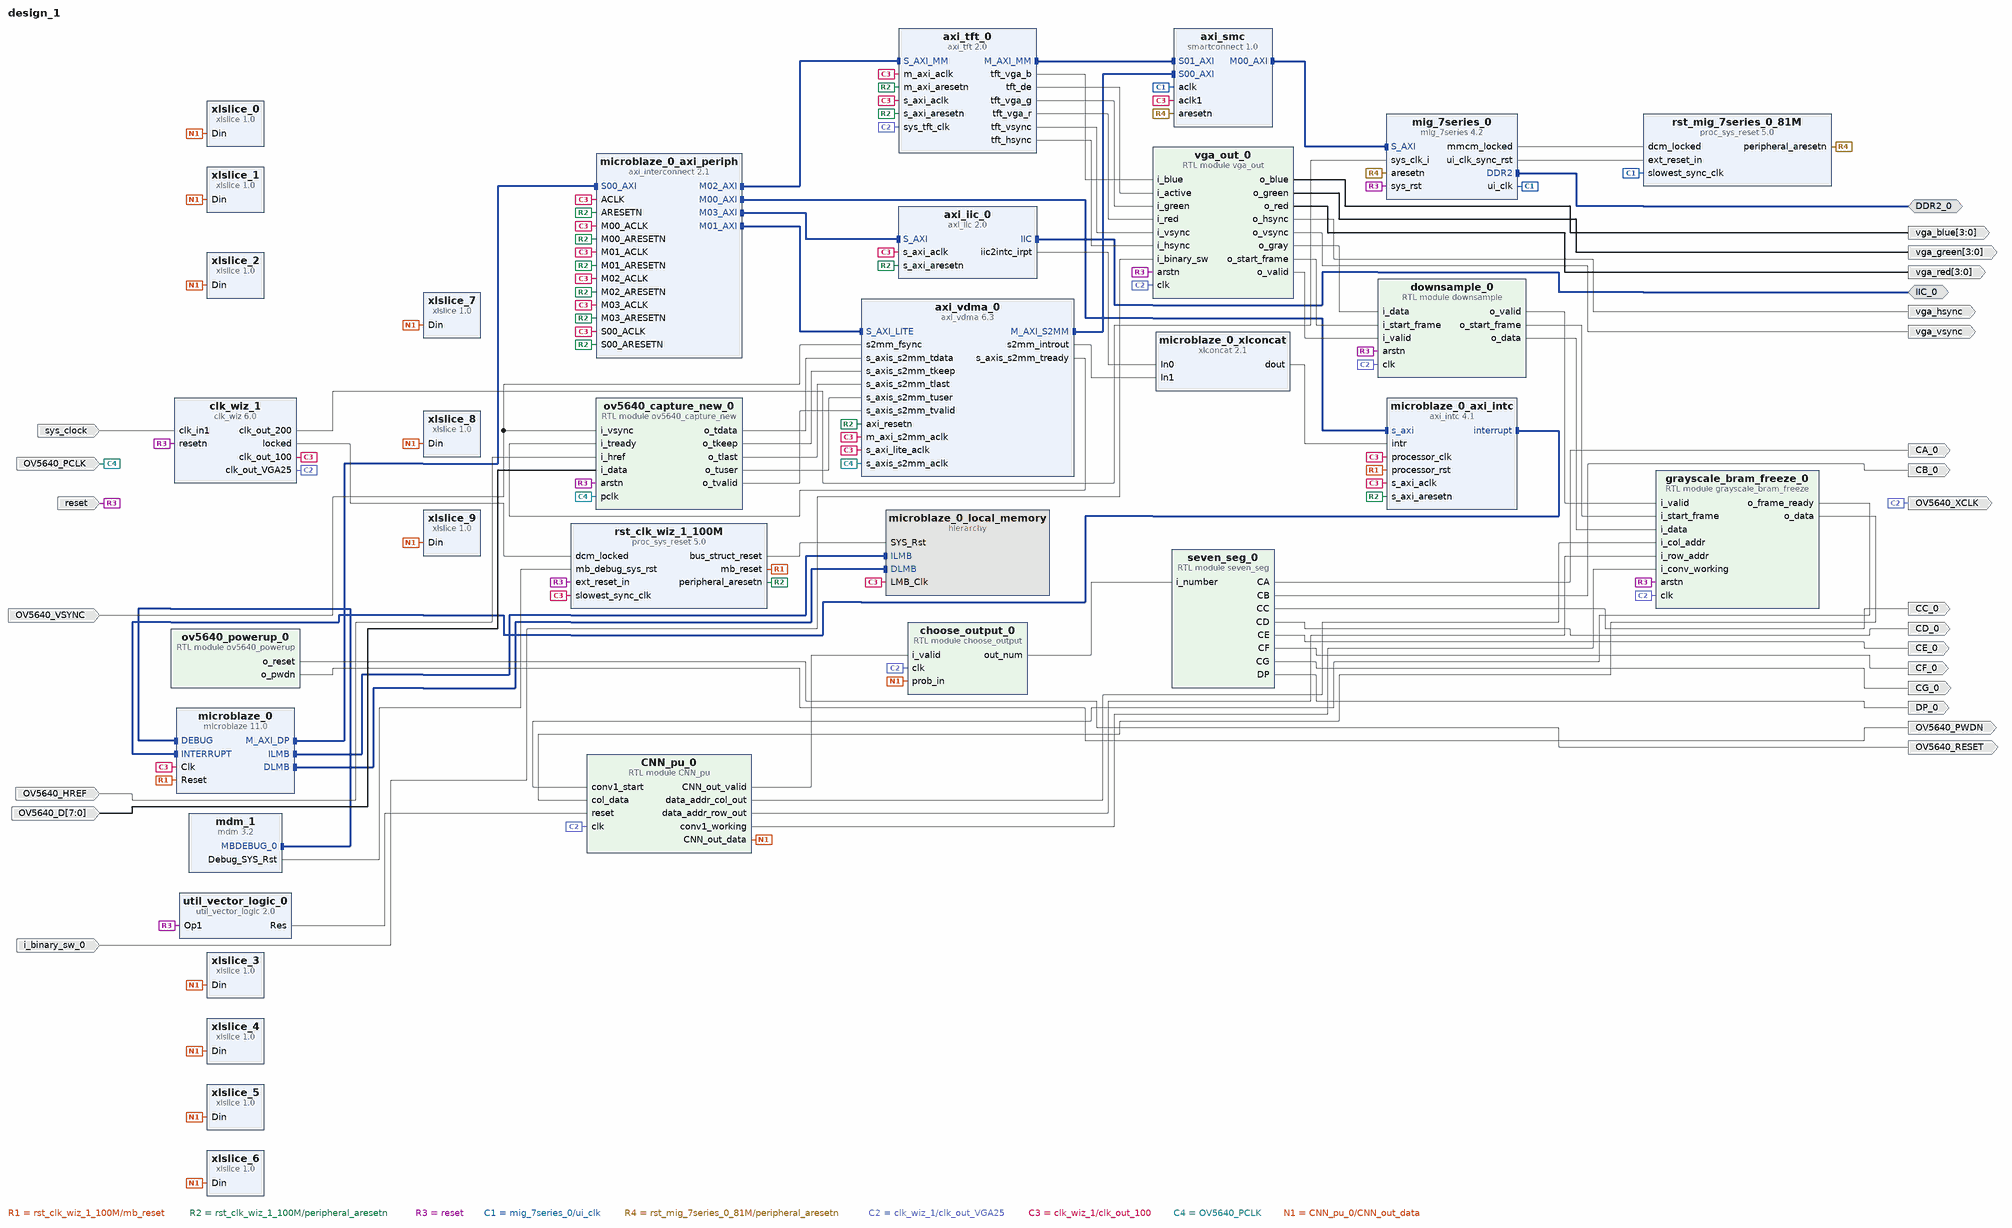
[diagram p0: block diagram of the top level]
# Vivado block design design_1, xc7a100tcsg324-1, Vivado 2018.3
create_bd_design design_1

create_bd_intf_port -mode Master -vlnv xilinx.com:interface:ddrx_rtl:1.0 DDR2_0
create_bd_intf_port -mode Master -vlnv xilinx.com:interface:iic_rtl:1.0 IIC_0
create_bd_port -dir I -type clk sys_clock
create_bd_port -dir I -type rst reset
set_property -dict {CONFIG.POLARITY ACTIVE_LOW} [get_bd_ports reset]
create_bd_port -dir O -type clk OV5640_XCLK
set_property -dict {CONFIG.FREQ_HZ 25000000} [get_bd_ports OV5640_XCLK]
create_bd_port -dir I -type clk OV5640_PCLK
set_property -dict {CONFIG.ASSOCIATED_BUSIF frame_in} [get_bd_ports OV5640_PCLK]
create_bd_port -dir O -from 3 -to 0 vga_red
create_bd_port -dir O -from 3 -to 0 vga_green
create_bd_port -dir O -from 3 -to 0 vga_blue
create_bd_port -dir I OV5640_VSYNC
create_bd_port -dir I OV5640_HREF
create_bd_port -dir I -from 7 -to 0 OV5640_D
create_bd_port -dir O vga_hsync
create_bd_port -dir O vga_vsync
create_bd_port -dir O -type rst OV5640_RESET
create_bd_port -dir O OV5640_PWDN
create_bd_port -dir O CA_0
create_bd_port -dir O CB_0
create_bd_port -dir O CC_0
create_bd_port -dir O CD_0
create_bd_port -dir O CE_0
create_bd_port -dir O CF_0
create_bd_port -dir O CG_0
create_bd_port -dir O DP_0
create_bd_port -dir I i_binary_sw_0

create_bd_cell -type ip -vlnv xilinx.com:ip:axi_intc:4.1 microblaze_0_axi_intc
set_property -dict {CONFIG.C_HAS_FAST 1} [get_bd_cells microblaze_0_axi_intc]
create_bd_cell -type ip -vlnv xilinx.com:ip:xlconcat:2.1 microblaze_0_xlconcat
create_bd_cell -type ip -vlnv xilinx.com:ip:mdm:3.2 mdm_1
create_bd_cell -type ip -vlnv xilinx.com:ip:clk_wiz:6.0 clk_wiz_1
set_property -dict [list \
  CONFIG.CLKOUT1_JITTER 151.636 \
  CONFIG.CLKOUT1_REQUESTED_OUT_FREQ 50 \
  CONFIG.CLKOUT2_JITTER 175.402 \
  CONFIG.CLKOUT2_PHASE_ERROR 98.575 \
  CONFIG.CLKOUT2_REQUESTED_OUT_FREQ 25.175 \
  CONFIG.CLKOUT2_USED true \
  CONFIG.CLKOUT3_JITTER 114.829 \
  CONFIG.CLKOUT3_PHASE_ERROR 98.575 \
  CONFIG.CLKOUT3_REQUESTED_OUT_FREQ 200 \
  CONFIG.CLKOUT3_USED true \
  CONFIG.CLK_IN1_BOARD_INTERFACE sys_clock \
  CONFIG.CLK_OUT1_PORT clk_out_100 \
  CONFIG.CLK_OUT2_PORT clk_out_VGA25 \
  CONFIG.CLK_OUT3_PORT clk_out_200 \
  CONFIG.MMCM_CLKOUT0_DIVIDE_F 20.000 \
  CONFIG.MMCM_CLKOUT1_DIVIDE 40 \
  CONFIG.MMCM_CLKOUT2_DIVIDE 5 \
  CONFIG.MMCM_DIVCLK_DIVIDE 1 \
  CONFIG.NUM_OUT_CLKS 3 \
  CONFIG.PRIM_SOURCE Single_ended_clock_capable_pin \
  CONFIG.RESET_BOARD_INTERFACE reset \
  CONFIG.RESET_PORT resetn \
  CONFIG.RESET_TYPE ACTIVE_LOW \
  CONFIG.USE_BOARD_FLOW true \
] [get_bd_cells clk_wiz_1]
create_bd_cell -type ip -vlnv xilinx.com:ip:proc_sys_reset:5.0 rst_clk_wiz_1_100M
set_property -dict {CONFIG.RESET_BOARD_INTERFACE reset CONFIG.USE_BOARD_FLOW true} [get_bd_cells rst_clk_wiz_1_100M]
create_bd_cell -type ip -vlnv xilinx.com:ip:mig_7series:4.2 mig_7series_0
set_property -dict {CONFIG.RESET_BOARD_INTERFACE reset} [get_bd_cells mig_7series_0]
create_bd_cell -type ip -vlnv xilinx.com:ip:axi_tft:2.0 axi_tft_0
set_property -dict {CONFIG.C_EN_I2C_INTF 0 CONFIG.C_TFT_INTERFACE 0} [get_bd_cells axi_tft_0]
create_bd_cell -type ip -vlnv xilinx.com:ip:smartconnect:1.0 axi_smc
set_property -dict {CONFIG.NUM_CLKS 2 CONFIG.NUM_SI 2} [get_bd_cells axi_smc]
create_bd_cell -type ip -vlnv xilinx.com:ip:proc_sys_reset:5.0 rst_mig_7series_0_81M
create_bd_cell -type ip -vlnv xilinx.com:ip:axi_iic:2.0 axi_iic_0
set_property -dict {CONFIG.IIC_BOARD_INTERFACE Custom CONFIG.IIC_FREQ_KHZ 10 CONFIG.USE_BOARD_FLOW true} [get_bd_cells axi_iic_0]
create_bd_cell -type ip -vlnv xilinx.com:ip:axi_vdma:6.3 axi_vdma_0
set_property -dict [list \
  CONFIG.c_include_mm2s 0 \
  CONFIG.c_num_fstores 5 \
  CONFIG.c_s2mm_genlock_mode 0 \
  CONFIG.c_s2mm_max_burst_length 8 \
  CONFIG.c_use_s2mm_fsync 1 \
] [get_bd_cells axi_vdma_0]
create_bd_cell -type ip -vlnv xilinx.com:ip:axi_interconnect:2.1 microblaze_0_axi_periph
set_property -dict {CONFIG.NUM_MI 4 CONFIG.NUM_SI 1} [get_bd_cells microblaze_0_axi_periph]
create_bd_cell -type hier microblaze_0_local_memory
create_bd_cell -type ip -vlnv xilinx.com:ip:microblaze:11.0 microblaze_0
set_property -dict {CONFIG.C_DEBUG_ENABLED 1 CONFIG.C_D_AXI 1 CONFIG.C_D_LMB 1 CONFIG.C_I_LMB 1} [get_bd_cells microblaze_0]
create_bd_cell -type module -reference ov5640_powerup ov5640_powerup_0
create_bd_cell -type module -reference ov5640_capture_new ov5640_capture_new_0
create_bd_cell -type ip -vlnv xilinx.com:ip:util_vector_logic:2.0 util_vector_logic_0
set_property -dict {CONFIG.C_OPERATION not CONFIG.C_SIZE 1} [get_bd_cells util_vector_logic_0]
create_bd_cell -type module -reference CNN_pu CNN_pu_0
create_bd_cell -type ip -vlnv xilinx.com:ip:xlslice:1.0 xlslice_0
set_property -dict {CONFIG.DIN_FROM 15 CONFIG.DIN_TO 0 CONFIG.DIN_WIDTH 160 CONFIG.DOUT_WIDTH 16} [get_bd_cells xlslice_0]
create_bd_cell -type ip -vlnv xilinx.com:ip:xlslice:1.0 xlslice_1
set_property -dict {CONFIG.DIN_FROM 31 CONFIG.DIN_TO 16 CONFIG.DIN_WIDTH 160 CONFIG.DOUT_WIDTH 16} [get_bd_cells xlslice_1]
create_bd_cell -type ip -vlnv xilinx.com:ip:xlslice:1.0 xlslice_2
set_property -dict {CONFIG.DIN_FROM 47 CONFIG.DIN_TO 32 CONFIG.DIN_WIDTH 160 CONFIG.DOUT_WIDTH 1} [get_bd_cells xlslice_2]
create_bd_cell -type ip -vlnv xilinx.com:ip:xlslice:1.0 xlslice_3
set_property -dict {CONFIG.DIN_FROM 63 CONFIG.DIN_TO 48 CONFIG.DIN_WIDTH 160 CONFIG.DOUT_WIDTH 1} [get_bd_cells xlslice_3]
create_bd_cell -type ip -vlnv xilinx.com:ip:xlslice:1.0 xlslice_4
set_property -dict {CONFIG.DIN_FROM 79 CONFIG.DIN_TO 64 CONFIG.DIN_WIDTH 160} [get_bd_cells xlslice_4]
create_bd_cell -type ip -vlnv xilinx.com:ip:xlslice:1.0 xlslice_5
set_property -dict {CONFIG.DIN_FROM 95 CONFIG.DIN_TO 80 CONFIG.DIN_WIDTH 160 CONFIG.DOUT_WIDTH 16} [get_bd_cells xlslice_5]
create_bd_cell -type ip -vlnv xilinx.com:ip:xlslice:1.0 xlslice_6
set_property -dict {CONFIG.DIN_FROM 111 CONFIG.DIN_TO 96 CONFIG.DIN_WIDTH 160 CONFIG.DOUT_WIDTH 1} [get_bd_cells xlslice_6]
create_bd_cell -type ip -vlnv xilinx.com:ip:xlslice:1.0 xlslice_7
set_property -dict {CONFIG.DIN_FROM 127 CONFIG.DIN_TO 112 CONFIG.DIN_WIDTH 160 CONFIG.DOUT_WIDTH 1} [get_bd_cells xlslice_7]
create_bd_cell -type ip -vlnv xilinx.com:ip:xlslice:1.0 xlslice_8
set_property -dict {CONFIG.DIN_FROM 143 CONFIG.DIN_TO 128 CONFIG.DIN_WIDTH 160 CONFIG.DOUT_WIDTH 1} [get_bd_cells xlslice_8]
create_bd_cell -type ip -vlnv xilinx.com:ip:xlslice:1.0 xlslice_9
set_property -dict {CONFIG.DIN_FROM 159 CONFIG.DIN_TO 144 CONFIG.DIN_WIDTH 160 CONFIG.DOUT_WIDTH 16} [get_bd_cells xlslice_9]
create_bd_cell -type module -reference choose_output choose_output_0
create_bd_cell -type module -reference seven_seg seven_seg_0
create_bd_cell -type module -reference vga_out vga_out_0
create_bd_cell -type module -reference downsample downsample_0
create_bd_cell -type module -reference grayscale_bram_freeze grayscale_bram_freeze_0

# ---- hierarchy /microblaze_0_local_memory ----
current_bd_instance /microblaze_0_local_memory
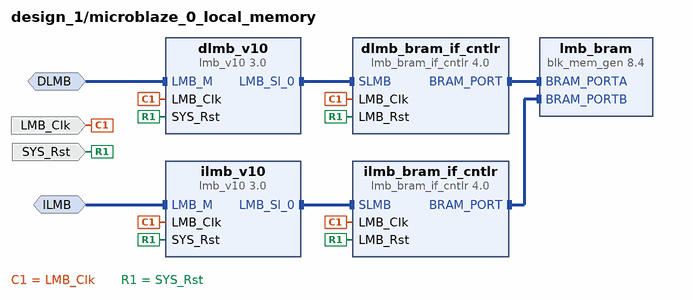
[diagram p1: block diagram inside /microblaze_0_local_memory]
create_bd_intf_pin -mode MirroredMaster -vlnv xilinx.com:interface:lmb_rtl:1.0 DLMB
create_bd_intf_pin -mode MirroredMaster -vlnv xilinx.com:interface:lmb_rtl:1.0 ILMB
create_bd_pin -dir I -type clk LMB_Clk
create_bd_pin -dir I -type rst SYS_Rst

create_bd_cell -type ip -vlnv xilinx.com:ip:lmb_v10:3.0 dlmb_v10
create_bd_cell -type ip -vlnv xilinx.com:ip:lmb_v10:3.0 ilmb_v10
create_bd_cell -type ip -vlnv xilinx.com:ip:lmb_bram_if_cntlr:4.0 dlmb_bram_if_cntlr
set_property -dict {CONFIG.C_ECC 0} [get_bd_cells dlmb_bram_if_cntlr]
create_bd_cell -type ip -vlnv xilinx.com:ip:lmb_bram_if_cntlr:4.0 ilmb_bram_if_cntlr
set_property -dict {CONFIG.C_ECC 0} [get_bd_cells ilmb_bram_if_cntlr]
create_bd_cell -type ip -vlnv xilinx.com:ip:blk_mem_gen:8.4 lmb_bram
set_property -dict {CONFIG.Memory_Type True_Dual_Port_RAM CONFIG.use_bram_block BRAM_Controller} [get_bd_cells lmb_bram]

# ---- connections ----

current_bd_instance /microblaze_0_local_memory
connect_bd_intf_net -intf_net microblaze_0_ilmb [get_bd_intf_pins ILMB] [get_bd_intf_pins ilmb_v10/LMB_M]
connect_bd_intf_net -intf_net microblaze_0_ilmb_bus [get_bd_intf_pins ilmb_v10/LMB_Sl_0] [get_bd_intf_pins ilmb_bram_if_cntlr/SLMB]
connect_bd_intf_net -intf_net microblaze_0_dlmb_cntlr [get_bd_intf_pins dlmb_bram_if_cntlr/BRAM_PORT] [get_bd_intf_pins lmb_bram/BRAM_PORTA]
connect_bd_intf_net -intf_net microblaze_0_dlmb [get_bd_intf_pins DLMB] [get_bd_intf_pins dlmb_v10/LMB_M]
connect_bd_intf_net -intf_net microblaze_0_dlmb_bus [get_bd_intf_pins dlmb_v10/LMB_Sl_0] [get_bd_intf_pins dlmb_bram_if_cntlr/SLMB]
connect_bd_intf_net -intf_net microblaze_0_ilmb_cntlr [get_bd_intf_pins ilmb_bram_if_cntlr/BRAM_PORT] [get_bd_intf_pins lmb_bram/BRAM_PORTB]
connect_bd_net -net microblaze_0_Clk [get_bd_pins LMB_Clk] \
  [get_bd_pins dlmb_v10/LMB_Clk] [get_bd_pins dlmb_bram_if_cntlr/LMB_Clk] [get_bd_pins ilmb_v10/LMB_Clk] \
  [get_bd_pins ilmb_bram_if_cntlr/LMB_Clk]
connect_bd_net [get_bd_pins SYS_Rst] \
  [get_bd_pins dlmb_v10/SYS_Rst] [get_bd_pins dlmb_bram_if_cntlr/LMB_Rst] [get_bd_pins ilmb_v10/SYS_Rst] \
  [get_bd_pins ilmb_bram_if_cntlr/LMB_Rst]
set_property HDL_ATTRIBUTE.BMM_INFO_ADDRESS_SPACE {byte  0x00000000 32 > design_1 microblaze_0_local_memory/lmb_bram} [get_bd_cells dlmb_bram_if_cntlr]
set_property HDL_ATTRIBUTE.KEEP_HIERARCHY yes [get_bd_cells dlmb_bram_if_cntlr]

current_bd_instance /
connect_bd_intf_net [get_bd_intf_pins microblaze_0_axi_intc/interrupt] [get_bd_intf_pins microblaze_0/INTERRUPT]
connect_bd_intf_net [get_bd_intf_pins mdm_1/MBDEBUG_0] [get_bd_intf_pins microblaze_0/DEBUG]
connect_bd_intf_net [get_bd_intf_pins microblaze_0_axi_periph/M02_AXI] [get_bd_intf_pins axi_tft_0/S_AXI_MM]
connect_bd_intf_net [get_bd_intf_pins axi_tft_0/M_AXI_MM] [get_bd_intf_pins axi_smc/S01_AXI]
connect_bd_intf_net [get_bd_intf_ports IIC_0] [get_bd_intf_pins axi_iic_0/IIC]
connect_bd_intf_net [get_bd_intf_pins microblaze_0_axi_periph/M03_AXI] [get_bd_intf_pins axi_iic_0/S_AXI]
connect_bd_intf_net [get_bd_intf_pins microblaze_0/ILMB] [get_bd_intf_pins microblaze_0_local_memory/ILMB]
connect_bd_intf_net [get_bd_intf_pins axi_smc/M00_AXI] [get_bd_intf_pins mig_7series_0/S_AXI]
connect_bd_intf_net [get_bd_intf_pins microblaze_0_axi_periph/M01_AXI] [get_bd_intf_pins axi_vdma_0/S_AXI_LITE]
connect_bd_intf_net [get_bd_intf_pins axi_vdma_0/M_AXI_S2MM] [get_bd_intf_pins axi_smc/S00_AXI]
connect_bd_intf_net -intf_net microblaze_0_intc_axi [get_bd_intf_pins microblaze_0_axi_periph/M00_AXI] [get_bd_intf_pins microblaze_0_axi_intc/s_axi]
connect_bd_intf_net [get_bd_intf_ports DDR2_0] [get_bd_intf_pins mig_7series_0/DDR2]
connect_bd_intf_net -intf_net microblaze_0_axi_dp [get_bd_intf_pins microblaze_0_axi_periph/S00_AXI] [get_bd_intf_pins microblaze_0/M_AXI_DP]
connect_bd_intf_net [get_bd_intf_pins microblaze_0/DLMB] [get_bd_intf_pins microblaze_0_local_memory/DLMB]
connect_bd_net -net microblaze_0_intr [get_bd_pins microblaze_0_xlconcat/dout] [get_bd_pins microblaze_0_axi_intc/intr]
connect_bd_net [get_bd_pins clk_wiz_1/locked] [get_bd_pins rst_clk_wiz_1_100M/dcm_locked]
connect_bd_net [get_bd_pins rst_clk_wiz_1_100M/mb_reset] [get_bd_pins microblaze_0_axi_intc/processor_rst] [get_bd_pins microblaze_0/Reset]
connect_bd_net [get_bd_pins rst_clk_wiz_1_100M/peripheral_aresetn] \
  [get_bd_pins microblaze_0_axi_intc/s_axi_aresetn] [get_bd_pins axi_tft_0/s_axi_aresetn] \
  [get_bd_pins axi_tft_0/m_axi_aresetn] [get_bd_pins axi_iic_0/s_axi_aresetn] [get_bd_pins axi_vdma_0/axi_resetn] \
  [get_bd_pins microblaze_0_axi_periph/ARESETN] [get_bd_pins microblaze_0_axi_periph/M03_ARESETN] \
  [get_bd_pins microblaze_0_axi_periph/M02_ARESETN] [get_bd_pins microblaze_0_axi_periph/M01_ARESETN] \
  [get_bd_pins microblaze_0_axi_periph/M00_ARESETN] [get_bd_pins microblaze_0_axi_periph/S00_ARESETN]
connect_bd_net [get_bd_pins mdm_1/Debug_SYS_Rst] [get_bd_pins rst_clk_wiz_1_100M/mb_debug_sys_rst]
connect_bd_net -net clk_in1_0_1 [get_bd_ports sys_clock] [get_bd_pins clk_wiz_1/clk_in1]
connect_bd_net [get_bd_ports reset] \
  [get_bd_pins clk_wiz_1/resetn] [get_bd_pins rst_clk_wiz_1_100M/ext_reset_in] [get_bd_pins mig_7series_0/sys_rst] \
  [get_bd_pins ov5640_capture_new_0/arstn] [get_bd_pins util_vector_logic_0/Op1] [get_bd_pins vga_out_0/arstn] \
  [get_bd_pins downsample_0/arstn] [get_bd_pins grayscale_bram_freeze_0/arstn]
connect_bd_net [get_bd_pins mig_7series_0/ui_clk] [get_bd_pins axi_smc/aclk] [get_bd_pins rst_mig_7series_0_81M/slowest_sync_clk]
connect_bd_net [get_bd_pins mig_7series_0/mmcm_locked] [get_bd_pins rst_mig_7series_0_81M/dcm_locked]
connect_bd_net [get_bd_pins mig_7series_0/ui_clk_sync_rst] [get_bd_pins rst_mig_7series_0_81M/ext_reset_in]
connect_bd_net [get_bd_pins rst_mig_7series_0_81M/peripheral_aresetn] [get_bd_pins mig_7series_0/aresetn] [get_bd_pins axi_smc/aresetn]
connect_bd_net [get_bd_pins clk_wiz_1/clk_out_VGA25] \
  [get_bd_ports OV5640_XCLK] [get_bd_pins axi_tft_0/sys_tft_clk] [get_bd_pins CNN_pu_0/clk] [get_bd_pins choose_output_0/clk] \
  [get_bd_pins vga_out_0/clk] [get_bd_pins downsample_0/clk] [get_bd_pins grayscale_bram_freeze_0/clk]
connect_bd_net [get_bd_pins clk_wiz_1/clk_out_200] [get_bd_pins mig_7series_0/sys_clk_i]
connect_bd_net [get_bd_pins clk_wiz_1/clk_out_100] \
  [get_bd_pins microblaze_0_axi_intc/s_axi_aclk] [get_bd_pins axi_tft_0/s_axi_aclk] [get_bd_pins axi_tft_0/m_axi_aclk] \
  [get_bd_pins axi_iic_0/s_axi_aclk] [get_bd_pins microblaze_0_axi_intc/processor_clk] \
  [get_bd_pins rst_clk_wiz_1_100M/slowest_sync_clk] [get_bd_pins axi_smc/aclk1] [get_bd_pins axi_vdma_0/s_axi_lite_aclk] \
  [get_bd_pins axi_vdma_0/m_axi_s2mm_aclk] [get_bd_pins microblaze_0_axi_periph/ACLK] \
  [get_bd_pins microblaze_0_axi_periph/M03_ACLK] [get_bd_pins microblaze_0_axi_periph/M02_ACLK] \
  [get_bd_pins microblaze_0_axi_periph/M01_ACLK] [get_bd_pins microblaze_0_axi_periph/M00_ACLK] \
  [get_bd_pins microblaze_0_axi_periph/S00_ACLK] [get_bd_pins microblaze_0_local_memory/LMB_Clk] \
  [get_bd_pins microblaze_0/Clk]
connect_bd_net -net s_axis_s2mm_aclk_0_1 [get_bd_ports OV5640_PCLK] [get_bd_pins axi_vdma_0/s_axis_s2mm_aclk] [get_bd_pins ov5640_capture_new_0/pclk]
connect_bd_net [get_bd_pins axi_vdma_0/s2mm_introut] [get_bd_pins microblaze_0_xlconcat/In1]
connect_bd_net [get_bd_pins axi_iic_0/iic2intc_irpt] [get_bd_pins microblaze_0_xlconcat/In0]
connect_bd_net [get_bd_pins rst_clk_wiz_1_100M/bus_struct_reset] [get_bd_pins microblaze_0_local_memory/SYS_Rst]
connect_bd_net [get_bd_pins vga_out_0/o_red] [get_bd_ports vga_red]
connect_bd_net [get_bd_pins vga_out_0/o_green] [get_bd_ports vga_green]
connect_bd_net [get_bd_pins vga_out_0/o_blue] [get_bd_ports vga_blue]
connect_bd_net -net i_vsync_0_1 [get_bd_ports OV5640_VSYNC] [get_bd_pins axi_vdma_0/s2mm_fsync] [get_bd_pins ov5640_capture_new_0/i_vsync]
connect_bd_net -net i_href_0_1 [get_bd_ports OV5640_HREF] [get_bd_pins ov5640_capture_new_0/i_href]
connect_bd_net -net i_data_0_1 [get_bd_ports OV5640_D] [get_bd_pins ov5640_capture_new_0/i_data]
connect_bd_net [get_bd_pins ov5640_powerup_0/o_reset] [get_bd_ports OV5640_RESET]
connect_bd_net [get_bd_pins ov5640_powerup_0/o_pwdn] [get_bd_ports OV5640_PWDN]
connect_bd_net [get_bd_pins ov5640_capture_new_0/o_tdata] [get_bd_pins axi_vdma_0/s_axis_s2mm_tdata]
connect_bd_net [get_bd_pins ov5640_capture_new_0/o_tkeep] [get_bd_pins axi_vdma_0/s_axis_s2mm_tkeep]
connect_bd_net [get_bd_pins ov5640_capture_new_0/o_tlast] [get_bd_pins axi_vdma_0/s_axis_s2mm_tlast]
connect_bd_net [get_bd_pins ov5640_capture_new_0/o_tuser] [get_bd_pins axi_vdma_0/s_axis_s2mm_tuser]
connect_bd_net [get_bd_pins ov5640_capture_new_0/o_tvalid] [get_bd_pins axi_vdma_0/s_axis_s2mm_tvalid]
connect_bd_net [get_bd_pins axi_vdma_0/s_axis_s2mm_tready] [get_bd_pins ov5640_capture_new_0/i_tready]
connect_bd_net [get_bd_pins vga_out_0/o_vsync] [get_bd_ports vga_vsync]
connect_bd_net [get_bd_pins vga_out_0/o_hsync] [get_bd_ports vga_hsync]
connect_bd_net [get_bd_pins axi_tft_0/tft_vga_b] [get_bd_pins vga_out_0/i_blue]
connect_bd_net [get_bd_pins axi_tft_0/tft_de] [get_bd_pins vga_out_0/i_active]
connect_bd_net [get_bd_pins axi_tft_0/tft_vga_g] [get_bd_pins vga_out_0/i_green]
connect_bd_net [get_bd_pins axi_tft_0/tft_vga_r] [get_bd_pins vga_out_0/i_red]
connect_bd_net [get_bd_pins axi_tft_0/tft_vsync] [get_bd_pins vga_out_0/i_vsync]
connect_bd_net [get_bd_pins axi_tft_0/tft_hsync] [get_bd_pins vga_out_0/i_hsync]
connect_bd_net -net vga_out_0_out_gray [get_bd_pins vga_out_0/o_gray] [get_bd_pins downsample_0/i_data]
connect_bd_net -net vga_out_0_start_frame [get_bd_pins vga_out_0/o_start_frame] [get_bd_pins downsample_0/i_start_frame]
connect_bd_net -net vga_out_0_out_valid [get_bd_pins vga_out_0/o_valid] [get_bd_pins downsample_0/i_valid]
connect_bd_net -net downsample_0_out_valid [get_bd_pins downsample_0/o_valid] [get_bd_pins grayscale_bram_freeze_0/i_valid]
connect_bd_net -net downsample_0_out_start_frame [get_bd_pins downsample_0/o_start_frame] [get_bd_pins grayscale_bram_freeze_0/i_start_frame]
connect_bd_net -net downsample_0_out_data [get_bd_pins downsample_0/o_data] [get_bd_pins grayscale_bram_freeze_0/i_data]
connect_bd_net [get_bd_pins util_vector_logic_0/Res] [get_bd_pins CNN_pu_0/reset]
connect_bd_net [get_bd_pins CNN_pu_0/data_addr_col_out] [get_bd_pins grayscale_bram_freeze_0/i_col_addr]
connect_bd_net [get_bd_pins CNN_pu_0/data_addr_row_out] [get_bd_pins grayscale_bram_freeze_0/i_row_addr]
connect_bd_net [get_bd_pins CNN_pu_0/CNN_out_data] \
  [get_bd_pins xlslice_0/Din] [get_bd_pins xlslice_9/Din] [get_bd_pins xlslice_1/Din] [get_bd_pins xlslice_2/Din] \
  [get_bd_pins xlslice_3/Din] [get_bd_pins xlslice_8/Din] [get_bd_pins xlslice_6/Din] [get_bd_pins xlslice_7/Din] \
  [get_bd_pins xlslice_4/Din] [get_bd_pins xlslice_5/Din] [get_bd_pins choose_output_0/prob_in]
connect_bd_net [get_bd_pins choose_output_0/out_num] [get_bd_pins seven_seg_0/i_number]
connect_bd_net [get_bd_pins seven_seg_0/CA] [get_bd_ports CA_0]
connect_bd_net [get_bd_pins seven_seg_0/CB] [get_bd_ports CB_0]
connect_bd_net [get_bd_pins seven_seg_0/CC] [get_bd_ports CC_0]
connect_bd_net [get_bd_pins seven_seg_0/CD] [get_bd_ports CD_0]
connect_bd_net [get_bd_pins seven_seg_0/CE] [get_bd_ports CE_0]
connect_bd_net [get_bd_pins seven_seg_0/CF] [get_bd_ports CF_0]
connect_bd_net [get_bd_pins seven_seg_0/CG] [get_bd_ports CG_0]
connect_bd_net [get_bd_pins seven_seg_0/DP] [get_bd_ports DP_0]
connect_bd_net [get_bd_pins CNN_pu_0/CNN_out_valid] [get_bd_pins choose_output_0/i_valid]
connect_bd_net [get_bd_pins CNN_pu_0/conv1_working] [get_bd_pins grayscale_bram_freeze_0/i_conv_working]
connect_bd_net [get_bd_pins grayscale_bram_freeze_0/o_frame_ready] [get_bd_pins CNN_pu_0/conv1_start]
connect_bd_net [get_bd_pins grayscale_bram_freeze_0/o_data] [get_bd_pins CNN_pu_0/col_data]
connect_bd_net -net i_binary_sw_0_1 [get_bd_ports i_binary_sw_0] [get_bd_pins vga_out_0/i_binary_sw]
set_property HDL_ATTRIBUTE.BMM_INFO_PROCESSOR {microblaze-le > design_1 microblaze_0_local_memory/dlmb_bram_if_cntlr} [get_bd_cells microblaze_0]
set_property HDL_ATTRIBUTE.KEEP_HIERARCHY yes [get_bd_cells microblaze_0]

# ---- address map ----
assign_bd_address -offset 0x80000000 -range 128M -target_address_space [get_bd_addr_spaces axi_tft_0/Video_data] [get_bd_addr_segs mig_7series_0/memmap/memaddr]
exclude_bd_addr_seg -offset 0x40800000 -range 64K -target_address_space [get_bd_addr_spaces axi_tft_0/Video_data] [get_bd_addr_segs axi_iic_0/S_AXI/Reg]
exclude_bd_addr_seg -offset 0x41200000 -range 64K -target_address_space [get_bd_addr_spaces axi_tft_0/Video_data] [get_bd_addr_segs microblaze_0_axi_intc/S_AXI/Reg]
exclude_bd_addr_seg -offset 0x44A00000 -range 64K -target_address_space [get_bd_addr_spaces axi_tft_0/Video_data] [get_bd_addr_segs axi_vdma_0/S_AXI_LITE/Reg]
exclude_bd_addr_seg -offset 0x44A10000 -range 64K -target_address_space [get_bd_addr_spaces axi_tft_0/Video_data] [get_bd_addr_segs axi_tft_0/S_AXI_MM/Reg]
assign_bd_address -offset 0x80000000 -range 128M -target_address_space [get_bd_addr_spaces axi_vdma_0/Data_S2MM] [get_bd_addr_segs mig_7series_0/memmap/memaddr]
assign_bd_address -offset 0x00000000 -range 32K -target_address_space [get_bd_addr_spaces microblaze_0/Data] [get_bd_addr_segs microblaze_0_local_memory/dlmb_bram_if_cntlr/SLMB/Mem]
assign_bd_address -offset 0x40800000 -range 64K -target_address_space [get_bd_addr_spaces microblaze_0/Data] [get_bd_addr_segs axi_iic_0/S_AXI/Reg]
assign_bd_address -offset 0x41200000 -range 64K -target_address_space [get_bd_addr_spaces microblaze_0/Data] [get_bd_addr_segs microblaze_0_axi_intc/S_AXI/Reg]
assign_bd_address -offset 0x44A00000 -range 64K -target_address_space [get_bd_addr_spaces microblaze_0/Data] [get_bd_addr_segs axi_vdma_0/S_AXI_LITE/Reg]
assign_bd_address -offset 0x44A10000 -range 64K -target_address_space [get_bd_addr_spaces microblaze_0/Data] [get_bd_addr_segs axi_tft_0/S_AXI_MM/Reg]
assign_bd_address -offset 0x00000000 -range 32K -target_address_space [get_bd_addr_spaces microblaze_0/Instruction] [get_bd_addr_segs microblaze_0_local_memory/ilmb_bram_if_cntlr/SLMB/Mem]

validate_bd_design
save_bd_design
